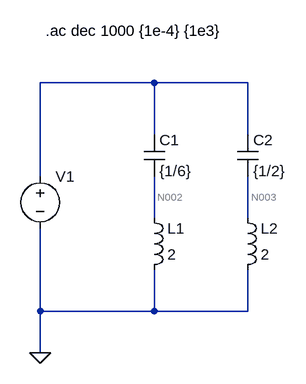
[diagram p0: schematic TS10_Foster_paralelo_LTSpice.asc]
TS10_Foster_paralelo_LTSpice.asc, the LTspice schematic file:
Version 4
SHEET 1 880 680
WIRE 224 16 48 16
WIRE 368 16 224 16
WIRE 224 96 224 16
WIRE 368 96 368 16
WIRE 48 160 48 16
WIRE 224 224 224 160
WIRE 368 224 368 160
WIRE 48 368 48 240
WIRE 224 368 224 304
WIRE 224 368 48 368
WIRE 368 368 368 304
WIRE 368 368 224 368
WIRE 48 432 48 368
FLAG 48 432 0
SYMBOL cap 208 160 M180
WINDOW 0 24 56 Left 2
WINDOW 3 24 8 Left 2
SYMATTR InstName C1
SYMATTR Value {1/6}
SYMBOL cap 352 160 M180
WINDOW 0 24 56 Left 2
WINDOW 3 24 8 Left 2
SYMATTR InstName C2
SYMATTR Value {1/2}
SYMBOL ind 208 320 M180
WINDOW 0 36 80 Left 2
WINDOW 3 36 40 Left 2
SYMATTR InstName L1
SYMATTR Value 2
SYMBOL ind 352 320 M180
WINDOW 0 36 80 Left 2
WINDOW 3 36 40 Left 2
SYMATTR InstName L2
SYMATTR Value 2
SYMBOL voltage 48 144 R0
WINDOW 39 0 0 Left 0
SYMATTR InstName V1
SYMATTR Value ""
SYMATTR Value2 AC 1 0
TEXT 56 -64 Left 2 !.ac dec 1000 {1e-4} {1e3}

The netlist it stands for:
* TS10_Foster_paralelo_LTSpice.asc
C1 N002 N001 {1/6}
C2 N003 N001 {1/2}
L1 0 N002 2
L2 0 N003 2
V1 N001 0 AC 1 0
.ac dec 1000 {1e-4} {1e3}
.backanno
.end

* Results of the author's LTspice run, read from the files saved beside the schematic
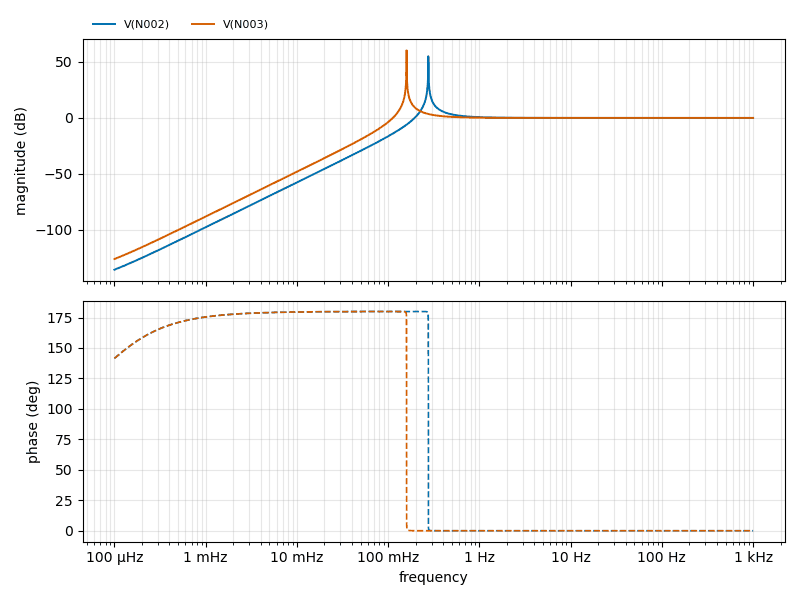
[diagram p1: AC Analysis of TS10_Foster_paralelo_LTSpice.asc, plotted from the saved traces]
* AC Analysis, 1 run:
*   V(N002): -135.48 dB at 100 µHz, 0.00 dB at 1 kHz, peak 55.00 dB at 275.4 mHz, 3 dB below the peak at 275.3 mHz and 275.9 mHz
*   V(N003): -125.94 dB at 100 µHz, 0.00 dB at 1 kHz, peak 60.29 dB at 159.2 mHz, 3 dB below the peak at 159.1 mHz and 159.3 mHz